# Altium project adapter_board.PrjPcb
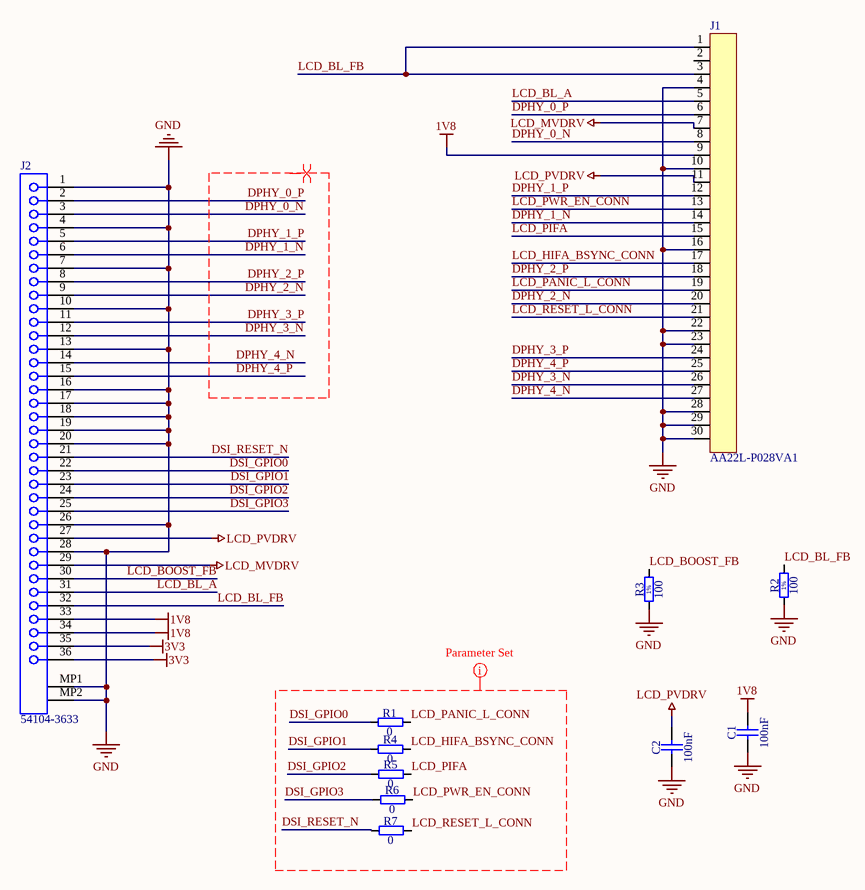
[diagram p0: board.SchDoc]
1 sheet, 11 parts. Net scope: global (net labels, ports and power ports of the same name join across sheets).
Board file: adapter.PcbDoc

## Sheet board.SchDoc
size A4

### Parts
C1  100nF  [CAPC2012X88N]
C2  100nF  [CAPC2012X88N]
J1  AA22L-P028VA1  [AA22L-P028VA1]
J2  54104-3633  [MOLX-54104-3633]
R1  0  [RESC2012X60N]
R2  100  [RESC2012X60N]
R3  100  [RESC2012X60N]
R4  0  [RESC2012X60N]
R5  0  [RESC2012X60N]
R6  0  [RESC2012X60N]
R7  0  [RESC2012X60N]

### Nets
1V8: C1.2 J1.9 J2.33 J2.34
3V3: J2.35 J2.36
GND: C1.1 C2.1 J1.4 J1.10 J1.16 J1.22 J1.23 J1.28 J1.29 J1.30 J2.1 J2.4 J2.7 J2.10 J2.13 J2.16 J2.17 J2.18 J2.19 J2.20 J2.26 J2.28 J2.MP1 J2.MP2 R2.1 R3.1
LCD_MVDRV: J1.7 J2.29
LCD_PVDRV: C2.2 J1.11 J2.27
DPHY_0_N: J1.8 J2.3
DPHY_0_P: J1.6 J2.2
DPHY_1_N: J1.14 J2.6
DPHY_1_P: J1.12 J2.5
DPHY_2_N: J1.20 J2.9
DPHY_2_P: J1.18 J2.8
DPHY_3_N: J1.26 J2.12
DPHY_3_P: J1.24 J2.11
DPHY_4_N: J1.27 J2.14
DPHY_4_P: J1.25 J2.15
DSI_GPIO0: J2.22 R1.1
DSI_GPIO1: J2.23 R4.1
DSI_GPIO2: J2.24 R5.1
DSI_GPIO3: J2.25 R6.1
DSI_RESET_N: J2.21 R7.1
LCD_BL_A: J1.5 J2.31
LCD_BL_FB: J1.1 J1.3 J2.32 R2.2
LCD_BOOST_FB: J2.30 R3.2
LCD_HIFA_BSYNC_CONN: J1.17 R4.2
LCD_PANIC_L_CONN: J1.19 R1.2
LCD_PIFA: J1.15 R5.2
LCD_PWR_EN_CONN: J1.13 R6.2
LCD_RESET_L_CONN: J1.21 R7.2

Not connected (* = marked no-connect by the designer): J1 2

### Layout directives
differential pair; net class DPHY_LANES; rule Width Constraint [Pref Width = 0.1mm    Min Width = 0.1mm    Max Width = 0.1mm]; rule Matched Net Lengths [Tolerance = 0.5mm]; rule Clearance Constraint [Clearance = 0.1mm]: DPHY_0_N, DPHY_0_P, DPHY_1_N, DPHY_1_P, DPHY_2_N, DPHY_2_P, DPHY_3_N, DPHY_3_P, DPHY_4_N, DPHY_4_P
rule Width Constraint [Pref Width = 0.1mm    Min Width = 0.1mm    Max Width = 0.2mm]; net class misc_nets: DSI_GPIO0, DSI_GPIO1, DSI_GPIO2, DSI_GPIO3, DSI_RESET_N, LCD_HIFA_BSYNC_CONN, LCD_PANIC_L_CONN, LCD_PIFA, LCD_PWR_EN_CONN, LCD_RESET_L_CONN

### Notes on the sheet
- (in symbol R0805_100R_1%_0.125W_100PPM) 1%

### Library data of the parts
C1 C2 = CC0805_100NF_50V_10%_X7R_YUDEN_UMK212B7104KGH: Non-polarised capacitor; Part Description: SMD Multilayer Chip Ceramic Capacitor (High Dielectric Type) for Automotive / Industrial Applications; Manufacturer: TAIYO YUDEN; Voltage: 50V; TC: X7R; Tolerance: ±10%; Part Number: CC0805_100NF_50V_10%_X7R_YUDEN_UMK212B7104KGH; Component Kind: Standard; Component Type: Standard; Pin Count: 2; Value: 100nF; Status: Not Recommended; Manufacturer Part Number: UMK212B7104KGH; Case: 0805; Mounted: Yes; Socket: No; SMD: Yes; Sense: No; ComponentHeight: 1.35mm; HelpURL: \\cern.ch\dfs\Applications\Altium\Datasheets\CC0805_TAIYO-YUDEN_UMK212B7104KGH.pdf; Author: CERN DEM JLC; CreateDate: 23.04.2015; LatestRevisionDate: 23.04.2015
J2 = 54104-3633: 0.5 mm Pitch Easy-On(TM) Type FPC Connector, 2.0 mm Mated Height, Right Angle, ZIF, SMT, Top Contact, 36 Circuits, -40 to 85 degC, ELV and RoHS Compliant, Tape and Reel; Manufacturer: Molex; Circuits (Loaded): 36; Current (Max per Contact): 0.5A; Durability (mating cycles max): 20; Entry Angle: 90degrees Angle; Mated Height: 2.00mm; Material - Metal: Phosphor Bronze; Material - Plating Mating: Silver, Tin-Bismuth; PCB Locator: No; PCB Retention: None; Pitch - Mating Interface: 0.50mm; Polarized to PCB: Yes; Voltage (Max): 50V; PackageVersion: Rev. C, 04/2014; PackageReference: 54104-3633; PackageDescription: 36-Lead FPC Connector, Pitch 0.5 mm; Supplier 1: Mouser; Supplier Part Number 1: 538-54104-3633; Contact Position: Top; Material - Plating Termination: Silver, Tin-Bismuth; Number of Rows: 1; Orientation: Right Angle; Packing: Tape and Reel; Pitch - Termination Interface: 0.50mm; RoHS: TRUE; Stackable: No; Mounting Technology: Surface Mount; PartNumber: 54104-3633; ComponentLink1Description: Manufacturer URL; ComponentLink1URL: http://www.molex.com/molex/index.jsp; ComponentLink2Description: Datasheet; ComponentLink2URL: http://www.molex.com/webdocs/datasheets/pdf/en-us/0541043633_FFC_FPC_CONNECTORS.pdf; ComponentLink3Description: Package Specification; ComponentLink3URL: http://www.molex.com/pdm_docs/sd/541043633_sd.pdf
R1 R4-R7 = R0805_0R_JUMPER: Resistor; Part Description: 2A (0.05R Max DC Resistance) Zero Ohm Jumper; Manufacturer: GENERIC; Manufacturer1 Part Number: NRC10Z0; PressFit: No; Part Number: R0805_0R_JUMPER; Component Kind: Standard; Component Type: Standard; Pin Count: 2; Value: 0; Status: Preferred; Manufacturer Part Number: R0805_0R_JUMPER; Case: 0805; Mounted: Yes; Sense: No; Socket: No; SMD: Yes; Manufacturer1 Example: NIC COMPONENT; Manufacturer1 ComponentHeight: 0.6mm; HelpURL: \\cern.ch\dfs\Applications\Altium\Datasheets\R0805_NIC_NRC.pdf; Author: CERN DEM JLC; CreateDate: 03.12.2007; LatestRevisionDate: 13.03.2008
R2 R3 = R0805_100R_1%_0.125W_100PPM: Resistor - 1%; Part Description: General Purpose Thick Film Chip Resistor; Manufacturer: GENERIC; Manufacturer1 Part Number: NRC10F4700TRF; Power: 0.125W; TC: ±100ppm/°C; PressFit: No; Part Number: R0805_100R_1%_0.125W_100PPM; Component Kind: Standard; Component Type: Standard; Pin Count: 2; Value: 100; Status: Preferred; Tolerance: ±1%; Manufacturer Part Number: R0805_100R_1%_0.125W_100PPM; Case: 0805; Mounted: Yes; Sense: No; Socket: No; SMD: Yes; Manufacturer1 Example: NIC COMPONENT; Manufacturer1 ComponentHeight: 0.6mm; HelpURL: \\cern.ch\dfs\Applications\Altium\Datasheets\R0805_NIC_NRC.pdf; Author: CERN DEM JLC; CreateDate: 03.12.2007; LatestRevisionDate: 13.03.2008